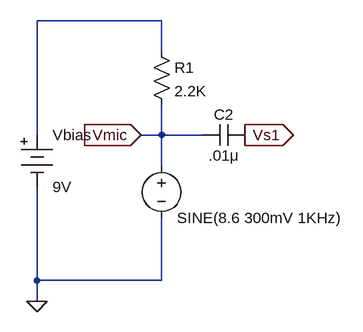
[diagram p0: schematic Decoupling Capacitor.asc]
Decoupling Capacitor.asc, the LTspice schematic file:
Version 4
SHEET 1 880 680
WIRE 528 144 336 144
WIRE 528 192 528 144
WIRE 336 320 336 144
WIRE 528 320 528 272
WIRE 528 320 496 320
WIRE 592 320 528 320
WIRE 528 368 528 320
WIRE 336 544 336 400
WIRE 528 544 528 448
WIRE 528 544 336 544
WIRE 336 576 336 544
FLAG 496 320 Vmic
IOPIN 496 320 In
FLAG 336 576 0
FLAG 656 320 Vs1
IOPIN 656 320 Out
SYMBOL res 512 176 R0
SYMATTR InstName R1
SYMATTR Value 2.2K
SYMBOL cap 656 304 R90
WINDOW 0 0 32 VBottom 2
WINDOW 3 32 32 VTop 2
SYMATTR InstName C2
SYMATTR Value .01μ
SYMBOL voltage 528 352 R0
WINDOW 0 24 16 Invisible 2
SYMATTR InstName V1
SYMATTR Value SINE(8.6 300mV 1KHz)
SYMBOL Misc/battery 336 304 R0
SYMATTR InstName Vbias
SYMATTR Value 9V

The netlist it stands for:
* Decoupling Capacitor.asc
R1 N001 Vmic 2.2K
C2 Vs1 Vmic .01μ
V1 Vmic 0 SINE(8.6 300mV 1KHz)
Vbias N001 0 9V
.backanno
.end